# Altium schematic sheet POWER_1.1.SchDoc
size A3
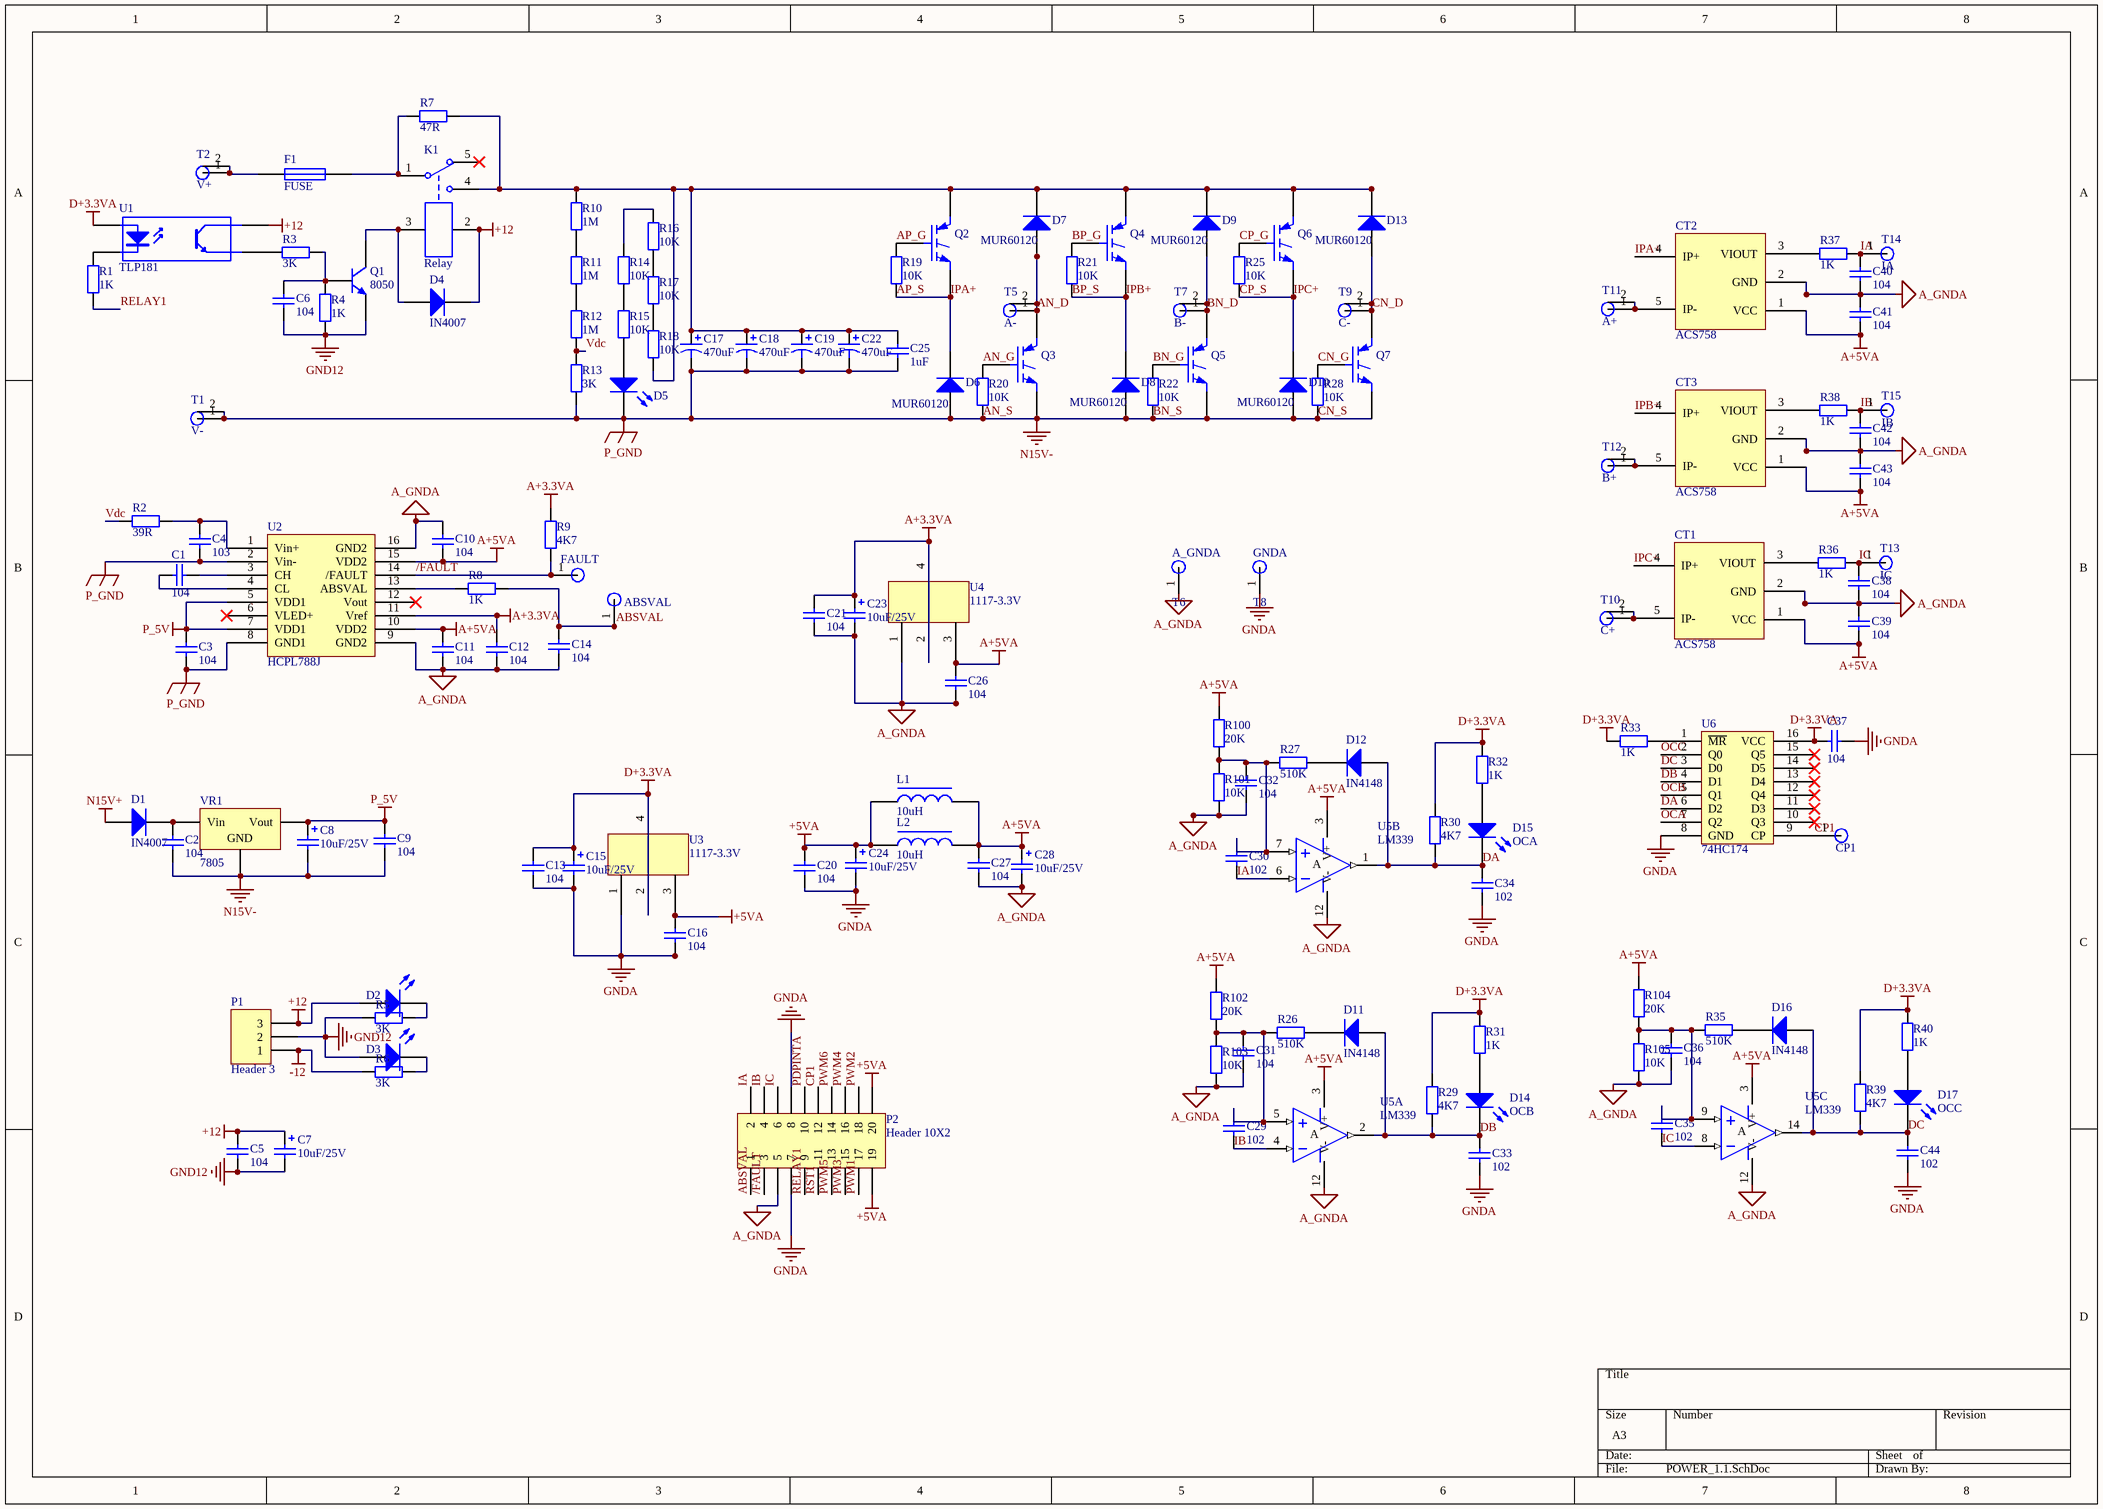
[diagram p0: POWER_1.1.SchDoc]

## Parts
C1  104  [C2012-0805]
C2  104  [C2012-0805]
C3  104  [C2012-0805]
C4  103  [C2012-0805]
C5  104  [C2012-0805]
C6  104  [C2012-0805]
C7  10uF/25V  [C_10UF/25V]
C8  10uF/25V  [C_10UF/25V]
C9  104  [C2012-0805]
C10  104  [C2012-0805]
C11  104  [C2012-0805]
C12  104  [C2012-0805]
C13  104  [C2012-0805]
C14  104  [C2012-0805]
C15  10uF/25V  [C_10UF/25V]
C16  104  [C2012-0805]
C17  470uF  [Rb400mil-450V]
C18  470uF  [Rb400mil-450V]
C19  470uF  [Rb400mil-450V]
C20  104  [C2012-0805]
C21  104  [C2012-0805]
C22  470uF  [Rb400mil-450V]
C23  10uF/25V  [C_10UF/25V]
C24  10uF/25V  [C_10UF/25V]
C25  1uF  [Rb800mil]
C26  104  [C2012-0805]
C27  104  [C2012-0805]
C28  10uF/25V  [C_10UF/25V]
C29  102  [C2012-0805]
C30  102  [C2012-0805]
C31  104  [C2012-0805]
C32  104  [C2012-0805]
C33  102  [C2012-0805]
C34  102  [C2012-0805]
C35  102  [C2012-0805]
C36  104  [C2012-0805]
C37  104  [C2012-0805]
C38  104  [C2012-0805]
C39  104  [C2012-0805]
C40  104  [C2012-0805]
C41  104  [C2012-0805]
C42  104  [C2012-0805]
C43  104  [C2012-0805]
C44  102  [C2012-0805]
CT1  ACS758  [ACS758-LCB-050U-PFF]
CT2  ACS758  [ACS758-LCB-050U-PFF]
CT3  ACS758  [ACS758-LCB-050U-PFF]
D1  IN4007  [DIODE4007]
D2  (no value)  [LED-SMD]
D3  (no value)  [LED-SMD]
D4  IN4007  [DIODE4007]
D5  LED  [LED-SMD]  (value not drawn)
D6  MUR60120  [DIO40A1200V]
D7  MUR60120  [DIO40A1200V]
D8  MUR60120  [DIO40A1200V]
D9  MUR60120  [DIO40A1200V]
D10  MUR60120  [DIO40A1200V]
D11  IN4148  [IN4148]
D12  IN4148  [IN4148]
D13  MUR60120  [DIO40A1200V]
D14  OCB  [LED-SMD]
D15  OCA  [LED-SMD]
D16  IN4148  [IN4148]
D17  OCC  [LED-SMD]
F1  FUSE  [FUSE]
K1  Relay  [Relay(30A)]
L1  10uH  [R2012-0805]
L2  10uH  [R2012-0805]
P1  Header 3  [HDR1X3]
P2  Header 10X2  [HDR2X10]
Q1  8050  [NPN8050]
Q2  (no value)  [IGBT TO247 40A 1200V]
Q3  (no value)  [IGBT TO247 40A 1200V]
Q4  (no value)  [IGBT TO247 40A 1200V]
Q5  (no value)  [IGBT TO247 40A 1200V]
Q6  (no value)  [IGBT TO247 40A 1200V]
Q7  (no value)  [IGBT TO247 40A 1200V]
R1  1K  [R2012-0805]
R2  39R  [R2012-0805]
R3  3K  [R2012-0805]
R4  1K  [R2012-0805]
R5  3K  [R2012-0805]
R6  3K  [R2012-0805]
R7  47R  [AXIAL-1*1.3]
R8  1K  [R2012-0805]
R9  4K7  [R2012-0805]
R10  1M  [R2012-0805]
R11  1M  [R2012-0805]
R12  1M  [R2012-0805]
R13  3K  [R2012-0805]
R14  10K  [R2012-0805]
R15  10K  [R2012-0805]
R16  10K  [R2012-0805]
R17  10K  [R2012-0805]
R18  10K  [R2012-0805]
R19  10K  [R2012-0805]
R20  10K  [R2012-0805]
R21  10K  [R2012-0805]
R22  10K  [R2012-0805]
R25  10K  [R2012-0805]
R26  510K  [R2012-0805]
R27  510K  [R2012-0805]
R28  10K  [R2012-0805]
R29  4K7  [R2012-0805]
R30  4K7  [R2012-0805]
R31  1K  [R2012-0805]
R32  1K  [R2012-0805]
R33  1K  [R2012-0805]
R35  510K  [R2012-0805]
R36  1K  [R2012-0805]
R37  1K  [R2012-0805]
R38  1K  [R2012-0805]
R39  4K7  [R2012-0805]
R40  1K  [R2012-0805]
R100  20K  [R2012-0805]
R101  10K  [R2012-0805]
R102  20K  [R2012-0805]
R103  10K  [R2012-0805]
R104  20K  [R2012-0805]
R105  10K  [R2012-0805]
T1  V-  [TEM]
T2  V+  [TEM]
T3  FAULT  [PIN1]
T4  ABSVAL  [PIN1]
T5  A-  [TEM]
T6  A_GNDA  [PIN1]
T7  B-  [TEM]
T8  GNDA  [PIN1]
T9  C-  [TEM]
T10  C+  [TEM]
T11  A+  [TEM]
T12  B+  [TEM]
T13  IC  [PIN1]
T14  IA  [PIN1]
T15  IB  [PIN1]
TP1  CP1  [PIN1]
U1  TLP181  [TLP181]
U2  HCPL788J  [HCPL788J]
U3  1117-3.3V  [1117-3.3V]
U4  1117-3.3V  [1117-3.3V]
U5  LM339  [LM339]  (parts A,B,C of 4)
U6  74HC174  [74HC174]
VR1  7805  [MC78L05]

## Nets
+5VA: C16.2 C20.2 C24.1 L1.1 L2.1 P2.19 P2.20 U3.3
+12: C5.1 C7.1 D2.1(A) D4.2(K) K1.2 P1.3 U1.6(C)
-12: P1.1 R6.1
A+3.3VA: C12.2 C21.2 C23.1 R9.2 U2.11(Vref) U4.2 U4.4
A+5VA: C10.1 C11.2 C26.2 C27.2 C28.1 C39.1 C41.1 C43.1 CT1.1(VCC) CT2.1(VCC) CT3.1(VCC) L1.2 L2.2 R100.1 R102.1 R104.1 U2.10(VDD2) U2.15(VDD2) U4.3 U5.3(V+)
A_GNDA: C10.2 C11.1 C12.1 C14.1 C21.1 C23.2 C26.1 C27.1 C28.2 C31.1 C32.1 C36.1 C38.1 C39.2 C40.1 C41.2 C42.1 C43.2 CT1.2(GND) CT2.2(GND) CT3.2(GND) P2.5 R101.2 R103.2 R105.2 T6.1(A) U2.9(GND2) U2.16(GND2) U4.1 U5.12(V-)
AN_S: C2.1 C3.2 C4.2 C8.2 C9.1 C17.2 C18.2 C19.2 C22.2 C25.1 D5.2(K) D6.3(A) D8.3(A) D10.3(A) Q3.3(E) Q5.3(E) Q7.3(E) R13.1 R20.1 R22.1 R28.1 T1.1(A) T1.2 U2.2(Vin-) U2.8(GND1) VR1.2(GND)  [also labelled BN_S, CN_S, N15V-, P_GND]
D+3.3VA: C13.2 C15.1 C37.2 R29.2 R30.2 R31.2 R32.2 R33.2 R39.2 R40.2 U1.1(A) U3.2 U3.4 U6.16(VCC)
GND12: C5.2 C6.1 C7.2 D3.1(A) P1.2 Q1.2(E) R4.1 R5.1
GNDA: C13.1 C15.2 C16.1 C20.1 C24.2 C33.1 C34.1 C37.1 C44.1 P2.7 P2.8 T8.1(A) U3.1 U6.8(GND)
N15V+: D1.1(A)
P_5V: C3.1 C8.1 C9.2 U2.5(VDD1) U2.7(VDD1) VR1.3(Vout)
/FAULT: P2.3 R9.1 T3.1(A) U2.14(/FAULT)
ABSVAL: C14.2 P2.1 R8.2 T4.1(A)
AN_D: D7.3(A) Q3.2(C) T5.1(A) T5.2
AN_G: Q3.1(G) R20.2
AP_G: Q2.1(G) R19.2
AP_S: CT2.4(IP+) D6.1(K) Q2.3(E) R19.1  [also labelled IPA+]
BN_D: D9.3(A) Q5.2(C) T7.1(A) T7.2
BN_G: Q5.1(G) R22.2
BP_G: Q4.1(G) R21.2
BP_S: CT3.4(IP+) D8.1(K) Q4.3(E) R21.1  [also labelled IPB+]
CN_D: D13.3(A) Q7.2(C) T9.1(A) T9.2
CN_G: Q7.1(G) R28.2
CP1: P2.12 TP1.1(A) U6.9(CP)
CP_G: Q6.1(G) R25.2
CP_S: CT1.4(IP+) D10.1(K) Q6.3(E) R25.1  [also labelled IPC+]
DA: C34.2 D12.1(A) D15.2(K) R30.1 U5.1(OUT) U6.6(D2)
DB: C33.2 D11.1(A) D14.2(K) R29.1 U5.2(OUT) U6.4(D1)
DC: C44.2 D16.1(A) D17.2(K) R39.1 U5.14(OUT) U6.3(D0)
IA: C30.1 C40.2 P2.2 R37.2 T14.1(A) U5.6(IN+)
IB: C29.1 C42.2 P2.4 R38.2 T15.1(A) U5.4(IN+)
IC: C35.1 C38.2 P2.6 R36.2 T13.1(A) U5.8(IN+)
OCA: U6.7(Q2)
OCB: U6.5(Q1)
OCC: U6.2(Q0)
PDPINTA: P2.10
PWM1: P2.17
PWM2: P2.18
PWM3: P2.15
PWM4: P2.16
PWM5: P2.13
PWM6: P2.14
RELAY1: P2.9 R1.2
RST1: P2.11
Vdc: R2.1 R12.1 R13.2
NetC1_1: C1.1 U2.4(CL)
NetC1_2: C1.2 U2.3(CH)
NetC2_2: C2.2 D1.2(K) VR1.1(Vin)
NetC4_1: C4.1 R2.2 U2.1(Vin+)
NetC6_2: C6.2 Q1.1(B) R3.1 R4.2
NetC17_1: C17.1 C18.1 C19.1 C22.1 C25.2 D7.1(K) D9.1(K) D13.1(K) K1.4 Q2.2(C) Q4.2(C) Q6.2(C) R7.1 R10.2 R18.1
NetC29_2: C29.2 C31.2 R26.2 R102.2 R103.1 U5.5(IN-)
NetC30_2: C30.2 C32.2 R27.2 R100.2 R101.1 U5.7(IN-)
NetC35_2: C35.2 C36.2 R35.2 R104.2 R105.1 U5.9(IN-)
NetCT1_3: CT1.3(VIOUT) R36.1
NetCT1_5: CT1.5(IP-) T10.1(A) T10.2
NetCT2_3: CT2.3(VIOUT) R37.1
NetCT2_5: CT2.5(IP-) T11.1(A) T11.2
NetCT3_3: CT3.3(VIOUT) R38.1
NetCT3_5: CT3.5(IP-) T12.1(A) T12.2
NetD2_2: D2.2(K) R5.2
NetD3_2: D3.2(K) R6.2
NetD4_1: D4.1(A) K1.3 Q1.3(C)
NetD5_1: D5.1(A) R15.1
NetD11_2: D11.2(K) R26.1
NetD12_2: D12.2(K) R27.1
NetD14_1: D14.1(A) R31.1
NetD15_1: D15.1(A) R32.1
NetD16_2: D16.2(K) R35.1
NetD17_1: D17.1(A) R40.1
NetF1_1: F1.1 T2.1(A) T2.2
NetF1_2: F1.2 K1.1 R7.2
NetR1_1: R1.1 U1.3(K)
NetR3_2: R3.2 U1.4(E)
NetR8_1: R8.1 U2.13(ABSVAL)
NetR10_1: R10.1 R11.2
NetR11_1: R11.1 R12.2
NetR14_1: R14.1 R15.2
NetR14_2: R14.2 R16.2
NetR16_1: R16.1 R17.2
NetR17_1: R17.1 R18.2
NetR33_1: R33.1 U6.1(~{MR})

Not connected (* = marked no-connect by the designer): K1 5*; U2 6(VLED+)* 12(Vout)*; U6 10(Q3)* 11(D3)* 12(Q4)* 13(D4)* 14(D5)* 15(Q5)*

## Notes on the sheet
- (in symbol LM339, part A) A
- (in symbol LM339, part B) A
- (in symbol LM339, part C) A

## Library data of the parts
C1-C6 C9-C14 C16 C20 C21 C26 C27 C29-C44 = Cap: 普通电容
  C1-C3 C5 C6 C9-C14 C16 C20 C21 C26 C27 C31 C32 C36-C43: Value: 104
  C4: Value: 103
  C29 C30 C33-C35 C44: Value: 102
C7 C8 C15 C23 C24 C28 = Cap tan: 钽电解; value: 10uF/25V
C17-C19 C22 = Cap pol1: 大电解电容; Value: 470uF
C25 = Cap CBB: CBB电容; Value: 1uF
D1 D4 = Diode IN4007: 普通整流二极管; value: IN4007
D2 D3 D14 D15 D17 = LED
D6-D10 D13 = Diode HFA08TB60
D11 D12 D16 = Diode IN4148: 开关二极管
K1 = Relay(30A)
L1 L2 = Inductor: Value: 10uH
P1 = Header 3: Header, 3-Pin; LatestRevisionDate: 17-Jul-2002; LatestRevisionNote: Re-released for DXP Platform.; Publisher: Altium Limited
P2 = Header 10X2: Header, 10-Pin, Dual row; LatestRevisionDate: 17-Jul-2002; LatestRevisionNote: Re-released for DXP Platform.; Publisher: Altium Limited
Q1 = NPN8050
Q2-Q7 = IGBT-N
R1-R22 R25-R33 R35-R40 R100-R105 = Res
  R1 R4 R8 R31-R33 R36-R38 R40: Value: 1K
  R2: Value: 39R
  R3 R5 R6 R13: Value: 3K
  R7: Value: 47R
  R9 R29 R30 R39: Value: 4K7
  R10-R12: Value: 1M
  R14-R22 R25 R28 R101 R103 R105: Value: 10K
  R26 R27 R35: Value: 510K
  R100 R102 R104: Value: 20K
T1 T2 T5 T7 T9-T12 = TEM: 电源端子
T3 T4 T6 T8 T13-T15 TP1 = TP: 测试脚
U3 U4 = 1117
U6 = 74HC174: 带公共时钟和复位六D触发器
VR1 = VR78: 三端稳压; value: 7805